# Altium project PCB_DS18B20_Control_Industry.PrjPcb
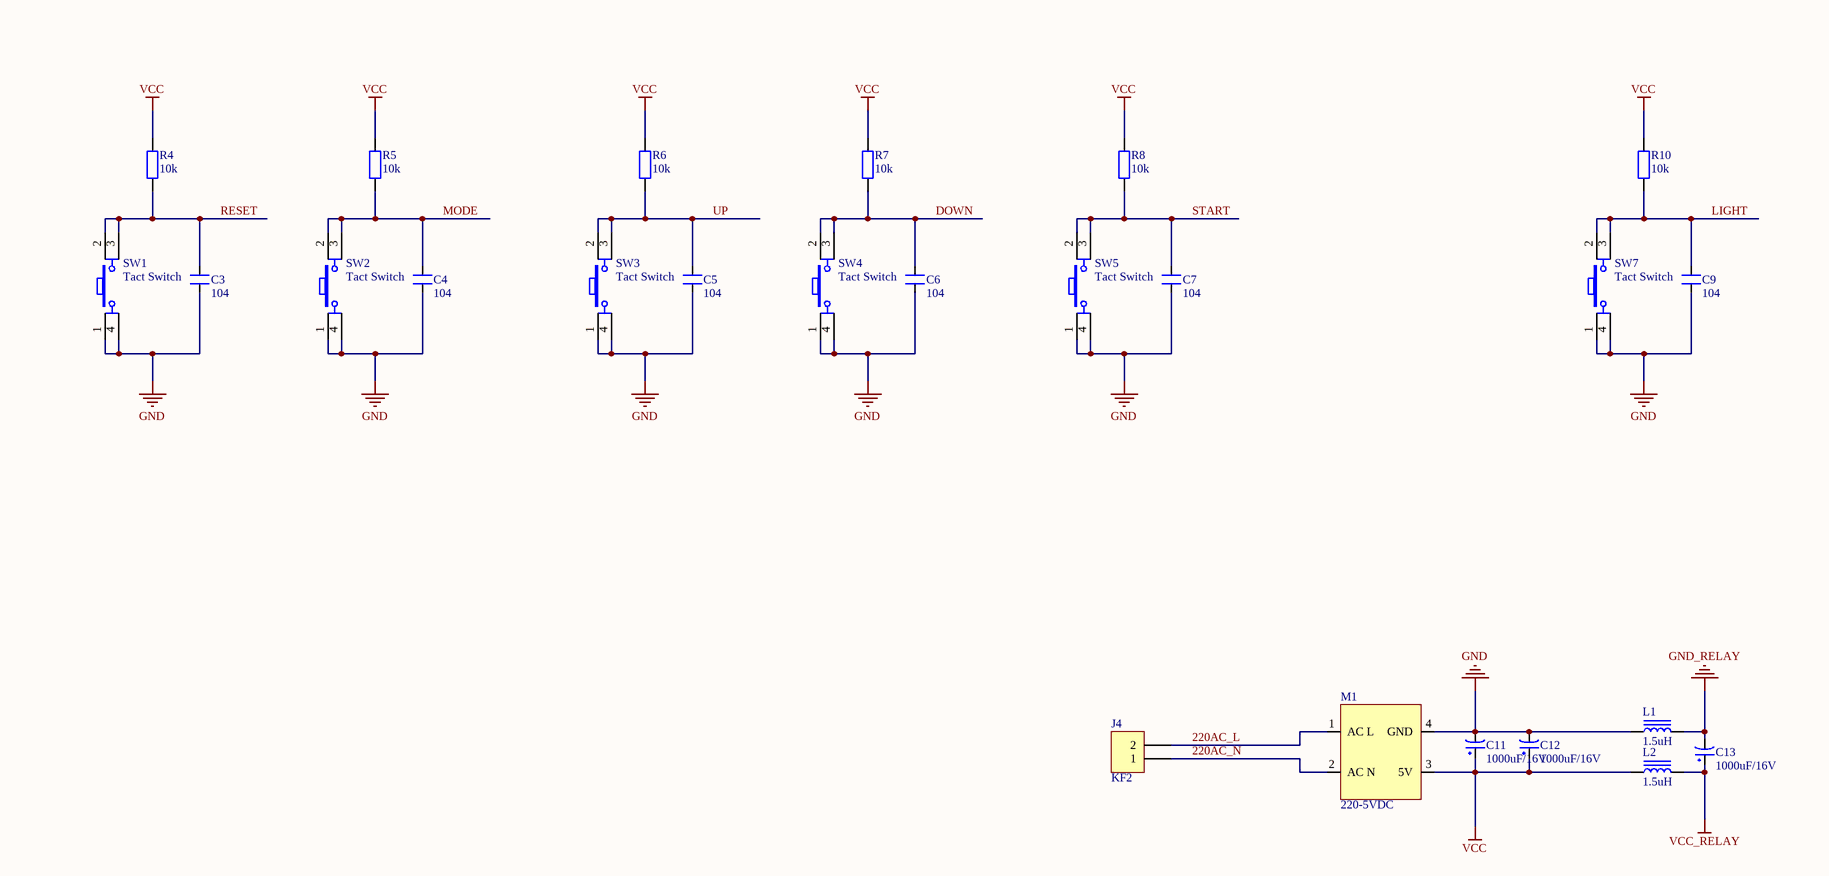
[diagram p0: DS18B20_Control_Industry.SchDoc, top left]
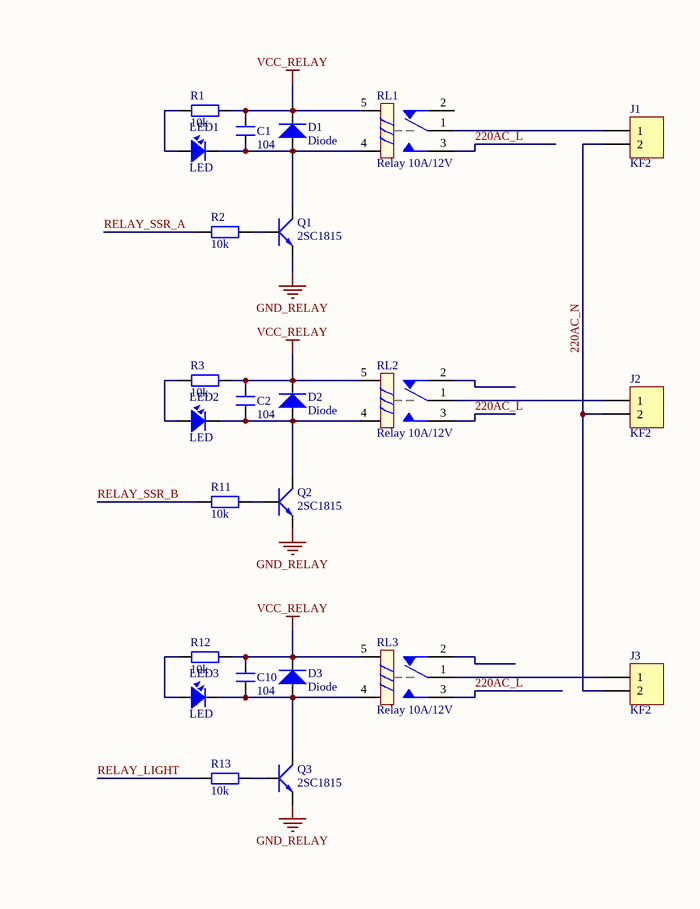
[diagram p1: DS18B20_Control_Industry.SchDoc, top right]
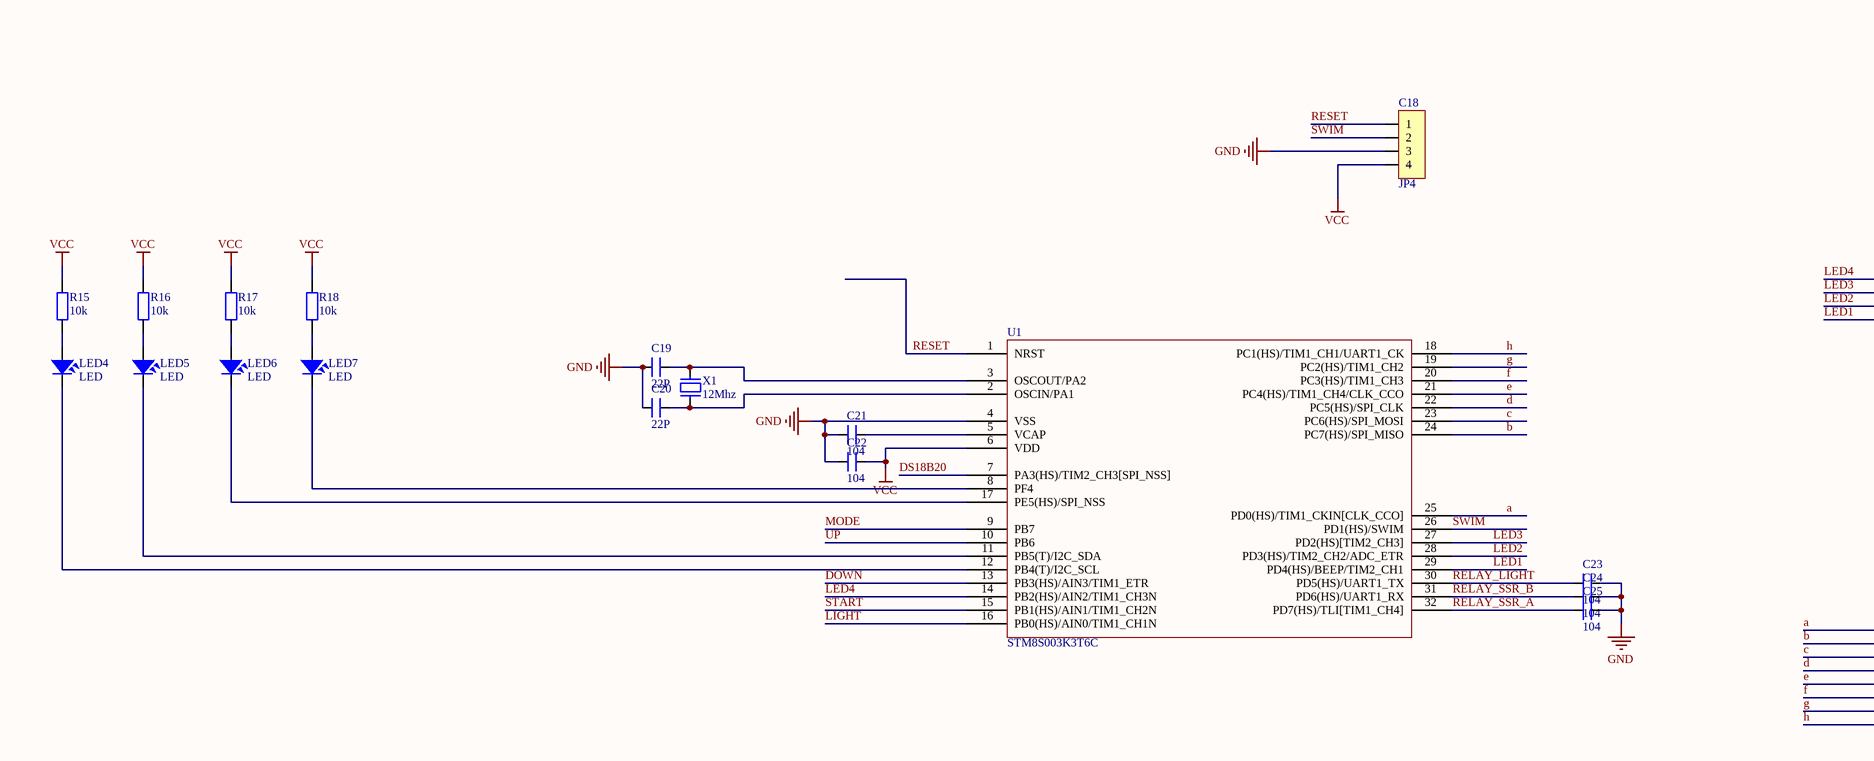
[diagram p2: DS18B20_Control_Industry.SchDoc, bottom left]
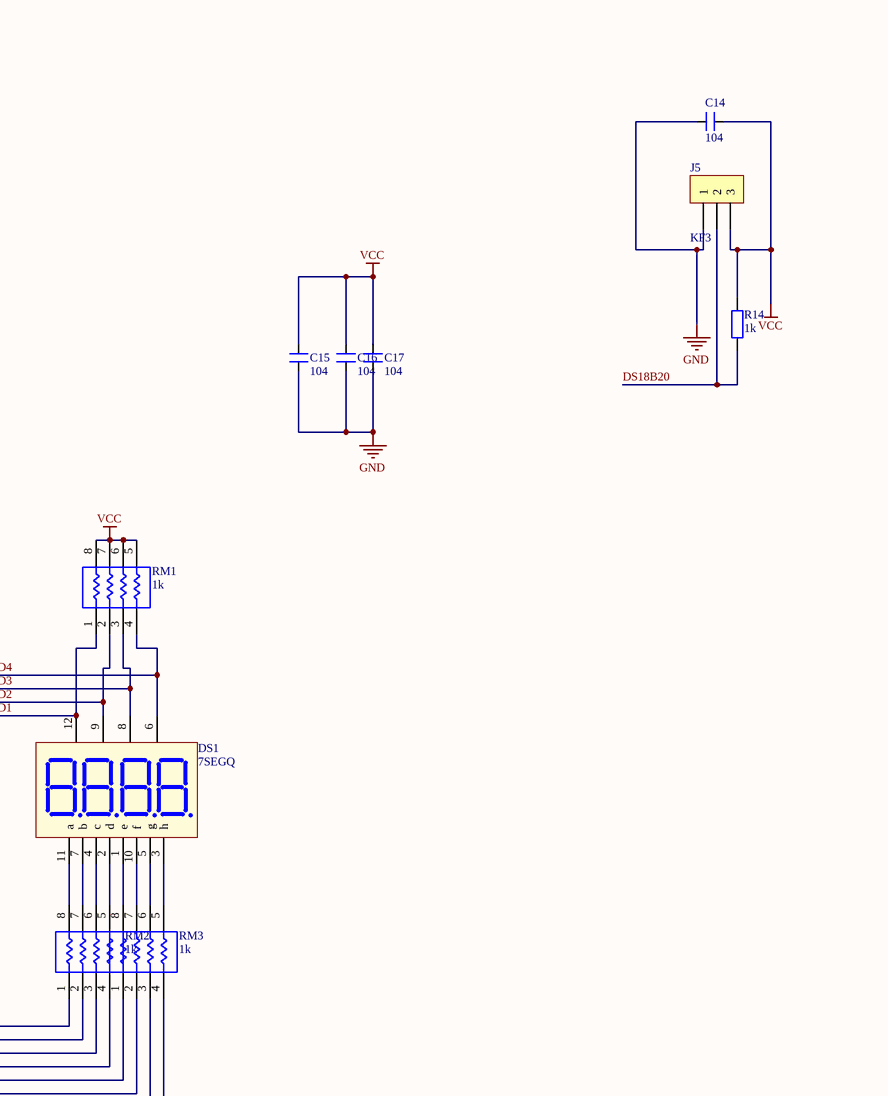
[diagram p3: DS18B20_Control_Industry.SchDoc, bottom right]
1 sheet, 77 parts. Net scope: global (net labels, ports and power ports of the same name join across sheets).
Board files: DS18B20_Control_Industry.PcbDoc, DS18B20_Industry_V2.PcbDoc

## Sheet DS18B20_Control_Industry.SchDoc
size A0

### Parts
C1  104  [SM-0805]
C2  104  [SM-0805]
C3  104  [SM-0805]
C4  104  [SM-0805]
C5  104  [SM-0805]
C6  104  [SM-0805]
C7  104  [SM-0805]
C9  104  [SM-0805]
C10  104  [SM-0805]
C11  1000uF/16V  [CP1.5/3.4]
C12  1000uF/16V  [CP1.5/3.4]
C13  1000uF/16V  [CP1.5/3.4]
C14  104  [SM-0805]
C15  104  [SM-0805]
C16  104  [SM-0805]
C17  104  [SM-0805]
C18  JP4  [JP4-C1T]
C19  22P  [SM-0805]
C20  22P  [SM-0805]
C21  104  [SM-0805]
C22  104  [SM-0805]
C23  104  [SM-0805]
C24  104  [SM-0805]
C25  104  [SM-0805]
D1  Diode  [DIO-SMD-106]
D2  Diode  [DIO-SMD-106]
D3  Diode  [DIO-SMD-106]
DS1  7SEGQ  [7SEGQ]
J1  KF2  [KF2-5.08]
J2  KF2  [KF2-5.08]
J3  KF2  [KF2-5.08]
J4  KF2  [KF2-5.08]
J5  KF3  [KF3-5.08]
L1  1.5uH  [BOURNS SRR6028]
L2  1.5uH  [BOURNS SRR6028]
LED1  LED  [SM-LED-0805-Blue]
LED2  LED  [SM-LED-0805-Blue]
LED3  LED  [SM-LED-0805-Blue]
LED4  LED  [LED-5-BLUE]
LED5  LED  [LED-5-BLUE]
LED6  LED  [LED-5-BLUE]
LED7  LED  [LED-5-BLUE]
M1  220-5VDC  [5V 700mA 3.5W AC DC]
Q1  2SC1815  [SOT23-321]
Q2  2SC1815  [SOT23-321]
Q3  2SC1815  [SOT23-321]
R1  10k  [RES-SMD-0805]
R2  10k  [RES-SMD-0805]
R3  10k  [RES-SMD-0805]
R4  10k  [RES-SMD-0805]
R5  10k  [RES-SMD-0805]
R6  10k  [RES-SMD-0805]
R7  10k  [RES-SMD-0805]
R8  10k  [RES-SMD-0805]
R10  10k  [RES-SMD-0805]
R11  10k  [RES-SMD-0805]
R12  10k  [RES-SMD-0805]
R13  10k  [RES-SMD-0805]
R14  1k  [RES-SMD-0805]
R15  10k  [RES-SMD-0805]
R16  10k  [RES-SMD-0805]
R17  10k  [RES-SMD-0805]
R18  10k  [RES-SMD-0805]
RL1  Relay 10A/12V  [RL_SPDT_10A]
RL2  Relay 10A/12V  [RL_SPDT_10A]
RL3  Relay 10A/12V  [RL_SPDT_10A]
RM1  1k  [RN4-0805]
RM2  1k  [RN4-0805]
RM3  1k  [RN4-0805]
SW1  Tact Switch  [SW4_12x12]
SW2  Tact Switch  [SW4_12x12]
SW3  Tact Switch  [SW4_12x12]
SW4  Tact Switch  [SW4_12x12]
SW5  Tact Switch  [SW4_12x12]
SW7  Tact Switch  [SW4_12x12]
U1  STM8S003K3T6C  [LQFP32T30]
X1  12Mhz  [XT2]

### Nets
GND: C3.1 C4.1 C5.1 C6.1 C7.1 C9.1 C11.2 C12.2 C14.1 C15.1 C16.1 C17.1 C18.3 C19.1 C20.1 C21.1 C22.1 C23.1 C24.1 C25.1 J5.1 L1.1 M1.4(GND) SW1.1 SW1.4 SW2.1 SW2.4 SW3.1 SW3.4 SW4.1 SW4.4 SW5.1 SW5.4 SW7.1 SW7.4 U1.4(VSS)
GND_RELAY: C13.2 L1.2 Q1.1(E) Q2.1(E) Q3.1(E)
VCC: C11.1 C12.1 C14.2 C15.2 C16.2 C17.2 C18.4 C22.2 J5.3 L2.1 M1.3(5V) R4.1 R5.1 R6.1 R7.1 R8.1 R10.1 R14.2 R15.2 R16.2 R17.2 R18.2 RM1.5 RM1.6 RM1.7 RM1.8 U1.6(VDD)
VCC_RELAY: C1.2 C2.2 C10.2 C13.1 D1.2 D2.2 D3.2 L2.2 R1.1 R3.1 R12.1 RL1.5 RL2.5 RL3.5
220AC_L: J4.2 M1.1(AC_L) RL1.3 RL2.3 RL3.3
220AC_N: J1.2 J2.2 J3.2 J4.1 M1.2(AC_N)
a: RM2.1 U1.25(PD0(HS)/TIM1_CKIN[CLK_CCO])
b: RM2.2 U1.24(PC7(HS)/SPI_MISO)
c: RM2.3 U1.23(PC6(HS)/SPI_MOSI)
d: RM2.4 U1.22(PC5(HS)/SPI_CLK)
DOWN: C6.2 R7.2 SW4.2 SW4.3 U1.13(PB3(HS)/AIN3/TIM1_ETR)
DS18B20: J5.2 R14.1 U1.7(PA3(HS)/TIM2_CH3[SPI_NSS])
e: RM3.1 U1.21(PC4(HS)/TIM1_CH4/CLK_CCO)
f: RM3.2 U1.20(PC3(HS)/TIM1_CH3)
g: RM3.3 U1.19(PC2(HS)/TIM1_CH2)
h: RM3.4 U1.18(PC1(HS)/TIM1_CH1/UART1_CK)
LED1: DS1.12(V1) RM1.1 U1.29(PD4(HS)/BEEP/TIM2_CH1)
LED2: DS1.9(V2) RM1.2 U1.28(PD3(HS)/TIM2_CH2/ADC_ETR)
LED3: DS1.8(V3) RM1.3 U1.27(PD2(HS)[TIM2_CH3])
LED4: DS1.6(V4) RM1.4 U1.14(PB2(HS)/AIN2/TIM1_CH3N)
LIGHT: C9.2 R10.2 SW7.2 SW7.3 U1.16(PB0(HS)/AIN0/TIM1_CH1N)
MODE: C4.2 R5.2 SW2.2 SW2.3 U1.9(PB7)
RELAY_LIGHT: C23.2 R13.2 U1.30(PD5(HS)/UART1_TX)
RELAY_SSR_A: C25.2 R2.2 U1.32(PD7(HS)/TLI[TIM1_CH4])
RELAY_SSR_B: C24.2 R11.2 U1.31(PD6(HS)/UART1_RX)
RESET: C3.2 C18.1 R4.2 SW1.2 SW1.3 U1.1(NRST)
START: C7.2 R8.2 SW5.2 SW5.3 U1.15(PB1(HS)/AIN1/TIM1_CH2N)
SWIM: C18.2 U1.26(PD1(HS)/SWIM)
UP: C5.2 R6.2 SW3.2 SW3.3 U1.10(PB6)
NetC1_1: C1.1 D1.1 LED1.2 Q1.2(C) RL1.4
NetC2_1: C2.1 D2.1 LED2.2 Q2.2(C) RL2.4
NetC10_1: C10.1 D3.1 LED3.2 Q3.2(C) RL3.4
NetC19_2: C19.2 U1.3(OSCOUT/PA2) X1.2
NetC20_2: C20.2 U1.2(OSCIN/PA1) X1.1
NetC21_2: C21.2 U1.5(VCAP)
NetDS1_1: DS1.1(e) RM3.8
NetDS1_2: DS1.2(d) RM2.5
NetDS1_3: DS1.3(h) RM3.5
NetDS1_4: DS1.4(c) RM2.6
NetDS1_5: DS1.5(g) RM3.6
NetDS1_7: DS1.7(b) RM2.7
NetDS1_10: DS1.10(f) RM3.7
NetDS1_11: DS1.11(a) RM2.8
NetJ1_1: J1.1 RL1.1
NetJ2_1: J2.1 RL2.1
NetJ3_1: J3.1 RL3.1
NetLED1_1: LED1.1 R1.2
NetLED2_1: LED2.1 R3.2
NetLED3_1: LED3.1 R12.2
NetLED4_1: LED4.1 R15.1
NetLED4_2: LED4.2 U1.12(PB4(T)/I2C_SCL)
NetLED5_1: LED5.1 R16.1
NetLED5_2: LED5.2 U1.11(PB5(T)/I2C_SDA)
NetLED6_1: LED6.1 R17.1
NetLED6_2: LED6.2 U1.17(PE5(HS)/SPI_NSS)
NetLED7_1: LED7.1 R18.1
NetLED7_2: LED7.2 U1.8(PF4)
NetQ1_3: Q1.3(B) R2.1
NetQ2_3: Q2.3(B) R11.1
NetQ3_3: Q3.3(B) R13.1

Not connected (* = marked no-connect by the designer): RL1 2; RL2 2; RL3 2

### Library data of the parts
C1-C7 C9 C10 C14-C17 C19-C25 = CM: Cap SMD; Value: 103
C11-C13 = CP4: Cap 1000uF/16V - 220uF/50V; Description 5: 4,7uF>10uF/250V_3,3uF>10uF/400V - 2,2uF>4,7uF/450V; Description 1: 2200uF-3300uF/6,3V - 1000uF-2200uF/10V; Description 2: 1000uF/16V - 470uF => 1000uF/25V - 100uF/100V; Description 3: 330uF>470uF/35V_220uF>470uF/50V_10uF>22uF/250V; Description 4: 220uF => 330uF/63V - 10uF =>33uF/160 - 200V; Value: 1000uF/16V
C18 = JP4: WR-PHD 2.54 mm Angled Socket Header; Manufacturer: W¨¹rth Elektronik eiSos GmbH; partNo: 613004143121; ComponentLink1 Description: Manufacturer; ComponentLink2 Description: Datasheet; NoPins: 04; Created Date: 29 March 2013; ComponentLink1URL: http://www.we-online.com; ComponentLink2URL: http://katalog.we-online.de/em/datasheet/6130xx143121.pdf; Created by: Karrer Zheng
DS1 = LED7Q: Four 7 Seg Dipslay; Value: LED 7Q SEG
J1-J4 = KF2: Manufacturer: Würth Elektronik eiSos GmbH; partNo: 691103110002; ComponentLink1 Description: Manufacturer; ComponentLink2 Description: Datasheet; NoPins: 2; Created Date: 29 October 2013; ComponentLink1URL: http://www.we-online.com; ComponentLink2URL: http://katalog.we-online.de/em/datasheet/6911031100xx.pdf; Created by: Karrer Zheng
J5 = KF3: Manufacturer: Würth Elektronik eiSos GmbH; partNo: 691103110003; ComponentLink1 Description: Manufacturer; ComponentLink2 Description: Datasheet; NoPins: 3; Created Date: 29 October 2013; ComponentLink1URL: http://www.we-online.com; ComponentLink2URL: http://katalog.we-online.de/em/datasheet/6911031100xx.pdf; Created by: Karrer Zheng
L1 L2 = Inductor: SMT Inductor; Value: 1.5uH
M1 = 5V 700mA 3.5W AC 220 to DC
Q1-Q3 = 2SC1815: NPN 600mW, ECB; Value: C1815
R1-R8 R10-R18 = R: Resistor R1/4W
RL1-RL3 = Relay 1: Relay SPDT,10A - 12VDC 5 Pin; Value: Relay SPDT, 10A, 12V
RM1-RM3 = ResPack
SW1-SW5 SW7 = SW4: Value: Button chip 4 pin
X1 = XT2: Crystal, 32.768 KHz, -40 to 85 degC, 3.2 x 1.5 x 0.9 mm SMD; Value: 4Mhz